# EAGLE design Board V1 (EAGLE 7.6.0)
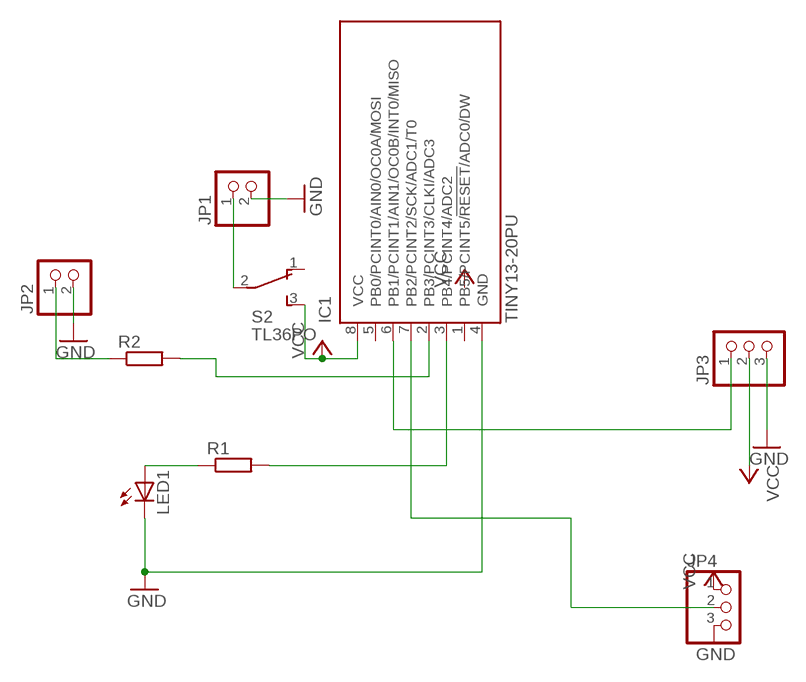
[diagram p0: schematic, sheet 1]

## Parts
IC1  TINY13-20PU  [DIL08]
JP1  PINHD-1X2  [1X02]
JP2  PINHD-1X2  [1X02]
JP3  PINHD-1X3  [1X03]
JP4  PINHD-1X3  [1X03]
LED1  LED5MM  [LED5MM]
R1  R-EU_0204/7  [0204/7]
R2  R-EU_0204/7  [0204/7]
S2  TL36PO  [TL3XPO]

## Nets
GND: IC1.4(GND) JP1.2 JP2.2 JP3.3 JP4.3 LED1.K(C)
N$1: JP2.1 R2.1
N$2: IC1.2(PB3/PCINT3/CLKI/ADC3) R2.2
N$3: IC1.3(PB4/PCINT4/ADC2) R1.2
N$4: IC1.6(PB1/PCINT1/AIN1/OC0B/INT0/MISO) JP3.1
N$5: JP1.1 S2.2(P)
N$6: LED1.A R1.1
N$8: IC1.7(PB2/PCINT2/SCK/ADC1/T0) JP4.2
VCC: IC1.8(VCC) JP3.2 JP4.1 S2.3(S)
Unconnected: IC1.1(PB5/PCINT5/!RESET!/ADC0/DW) IC1.5(PB0/PCINT0/AIN0/OC0A/MOSI) S2.1(O)

## Library data of the parts
IC1 = atmel:TINY13: 8-bit AVR Microcontroller with 1K Bytes In-System Programmable Flash Source: http://www.atmel.com/dyn/resources/prod_documents/2535S.pdf; MPN: ATTINY13-20PU; OC_FARNELL: 9171550; OC_NEWARK: 96K6521
JP1 JP2 = pinhead:PINHD-1X2: PIN HEADER
JP3 JP4 = pinhead:PINHD-1X3: PIN HEADER
LED1 = led:LED: LED OSRAM: - CHIPLED LG R971, LG N971, LY N971, LG Q971, LY Q971, LO R971, LY R971 LH N974, LH R974 LS Q976, LO Q976, LY Q976 LO Q996 - Hyper CHIPLED LW Q18S LB Q993, LB Q99A, LB R99A - SideLED LS A670, LO A670, LY A670, LG A670, LP A670 LB A673, LV A673, LT A673, LW A673 LH A674 LY A675 LS A676, LA A676, LO A676, LY A676, LW A676 LS A679, LY A679, LG A679 - Hyper Micro SIDELED® LS Y876, LA Y876, LO Y876, LY Y876 LT Y87S - SmartLED LW L88C, LW L88S LB L89C, LB L89S, LG L890 LS L89K, LO L89K, LY L89K LS L896, LA L896, LO L896, LY L896 - TOPLED LS T670, LO T670, LY T670, LG T670, LP T670 LSG T670, LSP T670, LSY T670, LOP T670, LYG T670 LG T671, LOG T671, LSG T671 LB T673, LV T673, LT T673, LW T673 LH T674 LS T676, LA T676, LO T676, LY T676, LB T676, LH T676, LSB T676, LW T676 LB T67C, LV T67C, LT T67C, LS T67K, LO T67K, LY T67K, LW E67C LS E67B, LA E67B, LO E67B, LY E67B, LB E67C, LV E67C, LT E67C LW T67C LS T679, LY T679, LG T679 LS T770, LO T770, LY T770, LG T770, LP T770 LB T773, LV T773, LT T773, LW T773 LH T774 LS E675, LA E675, LY E675, LS T675 LS T776, LA T776, LO T776, LY T776, LB T776 LHGB T686 LT T68C, LB T68C - Hyper Mini TOPLED® LB M676 - Mini TOPLED Santana® LG M470 LS M47K, LO M47K, LY M47K Source: http://www.osram.convergy.de LUXEON: - LUMILED® LXK2-PW12-R00, LXK2-PW12-S00, LXK2-PW14-U00, LXK2-PW14-V00 LXK2-PM12-R00, LXK2-PM12-S00, LXK2-PM14-U00 LXK2-PE12-Q00, LXK2-PE12-R00, LXK2-PE12-S00, LXK2-PE14-T00, LXK2-PE14-U00 LXK2-PB12-K00, LXK2-PB12-L00, LXK2-PB12-M00, LXK2-PB14-N00, LXK2-PB14-P00, LXK2-PB14-Q00 LXK2-PR12-L00, LXK2-PR12-M00, LXK2-PR14-Q00, LXK2-PR14-R00 LXK2-PD12-Q00, LXK2-PD12-R00, LXK2-PD12-S00 LXK2-PH12-R00, LXK2-PH12-S00 LXK2-PL12-P00, LXK2-PL12-Q00, LXK2-PL12-R00 Source: www.luxeon.com KINGBRIGHT: KA-3528ASYC Source: www.kingbright.com
R1 R2 = rcl:R-EU_: RESISTOR, European symbol
S2 = switch:TL36PO: TINY SWITCH ON - ON Source: http://www2.produktinfo.conrad.com/datenblaetter/700000-724999/705152-da-01-de-Subminiaturschalter_TL_36YO.pdf

## Board
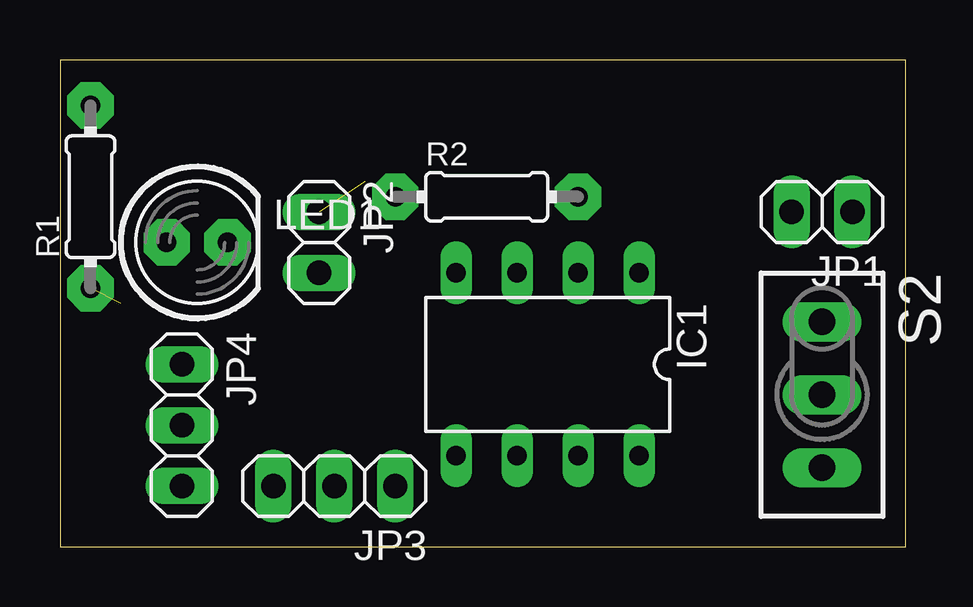
[diagram p1: board, top side]
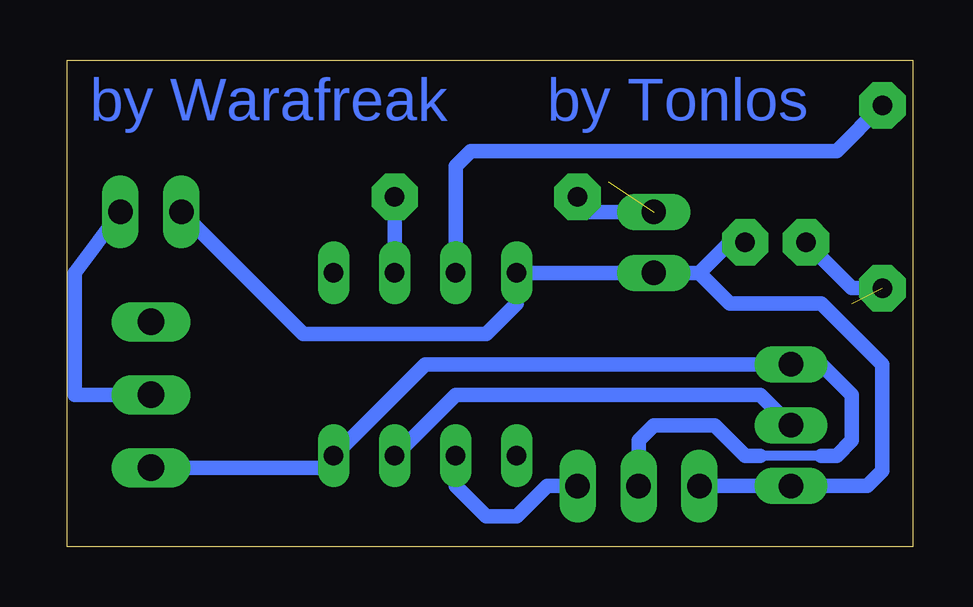
[diagram p2: board, bottom side, seen from below]

Size 35.23 x 20.31 mm. Coordinates in mm from the lower left corner, seen from the top.
Outline: 0,0 35.23,0 35.23,20.31 0,20.31 0,0
Copper layers (1*16): Top 0.035mm / dielectric 1.5mm / Bottom 0.035mm
Design rules "default": minimum track width 10mil, minimum drill 24mil, track to track 8mil, track to pad 8mil, pad to pad 8mil, via to via 8mil, smd to smd 8mil, copper to edge 40mil, drill to drill 8mil, minimum pad ring 10mil, minimum via ring 8mil, stop-mask expansion 4mil, vias tented up to drill 0mil, thermal gap 10mil

### Footprints (pad centres in the part's own frame; a part is rotated, then mirrored left to right if it is on the bottom)
DIL08 = drill 0.813 long: 1 -3.81,-3.81; 2 -1.27,-3.81; 3 1.27,-3.81; 4 3.81,-3.81; 5 3.81,3.81; 6 1.27,3.81; 7 -1.27,3.81; 8 -3.81,3.81
1X02 = drill 1.016 long: 1 -1.27,0; 2 1.27,0
1X03 = drill 1.016 long: 1 -2.54,0; 2 0,0; 3 2.54,0
LED5MM = drill 0.813 pad 1.93 octagon: A -1.27,0; K 1.27,0
0204/7 = drill 0.813 pad 1.93 octagon: 1 -3.81,0; 2 3.81,0
TL3XPO = drill 1.1 pad 1.422 long: 1 -3.04,0; 2 0,0; 3 3.04,0

### Placement (x,y rotation side)
IC1  20.32,7.62 180 top
JP1  31.75,13.97 180 top
JP2  10.79,12.7 270 top
JP3  11.43,2.54 180 top
JP4  5.08,5.08 270 top
LED1  5.71,12.7 0 top
R1  1.27,14.61 90 top
R2  17.78,14.61 0 top
S2  31.75,6.35 270 top

### Tracks (layer width: path | path; a pad name or v marks a point on that pad's centre or on a via)
GND
  Bottom 0.61: JP1.2 25.4,8.89 17.78,8.89 16.51,10.16 IC1.4 JP2.2 8.89,11.43 | 8.89,11.43 7.62,10.16 3.81,10.16 1.27,7.62 1.27,3.17 1.91,2.54 JP4.3 JP3.3 | LED1.K 7.62,12.7 8.89,11.43
N$1  (1 unrouted)
  Bottom 0.61: JP2.1 13.97,13.97 R2.1
N$2
  Bottom 0.61: IC1.2 R2.2
N$3
  Bottom 0.61: IC1.3 19.05,15.88 18.41,16.51 3.17,16.51 R1.2
N$4
  Bottom 0.61: JP3.1 15.24,2.54 16.51,1.27 17.78,1.27 19.05,2.54 IC1.6
N$5
  Bottom 0.61: JP1.1 34.92,11.43 34.92,6.35 S2.2
N$6  (1 unrouted)
  Bottom 0.61: R1.1 2.54,10.79 LED1.A
N$8
  Bottom 0.61: IC1.7 19.05,6.35 6.35,6.35 JP4.2
VCC
  Bottom 0.406: 3.81,3.81 6.35,3.81
  Bottom 0.61: S2.3 24.13,3.31 IC1.8 20.32,7.62 JP4.1 3.81,7.62 2.54,6.35 2.54,4.45 3.17,3.81 3.81,3.81 | JP3.2 11.43,4.45 10.79,5.08 8.26,5.08 6.99,3.81 6.35,3.81

### Text on the board
Bottom: by Tonlos | by Warafreak